# EAGLE schematic SCRIPPS_new_board_ (EAGLE 8.2.2)
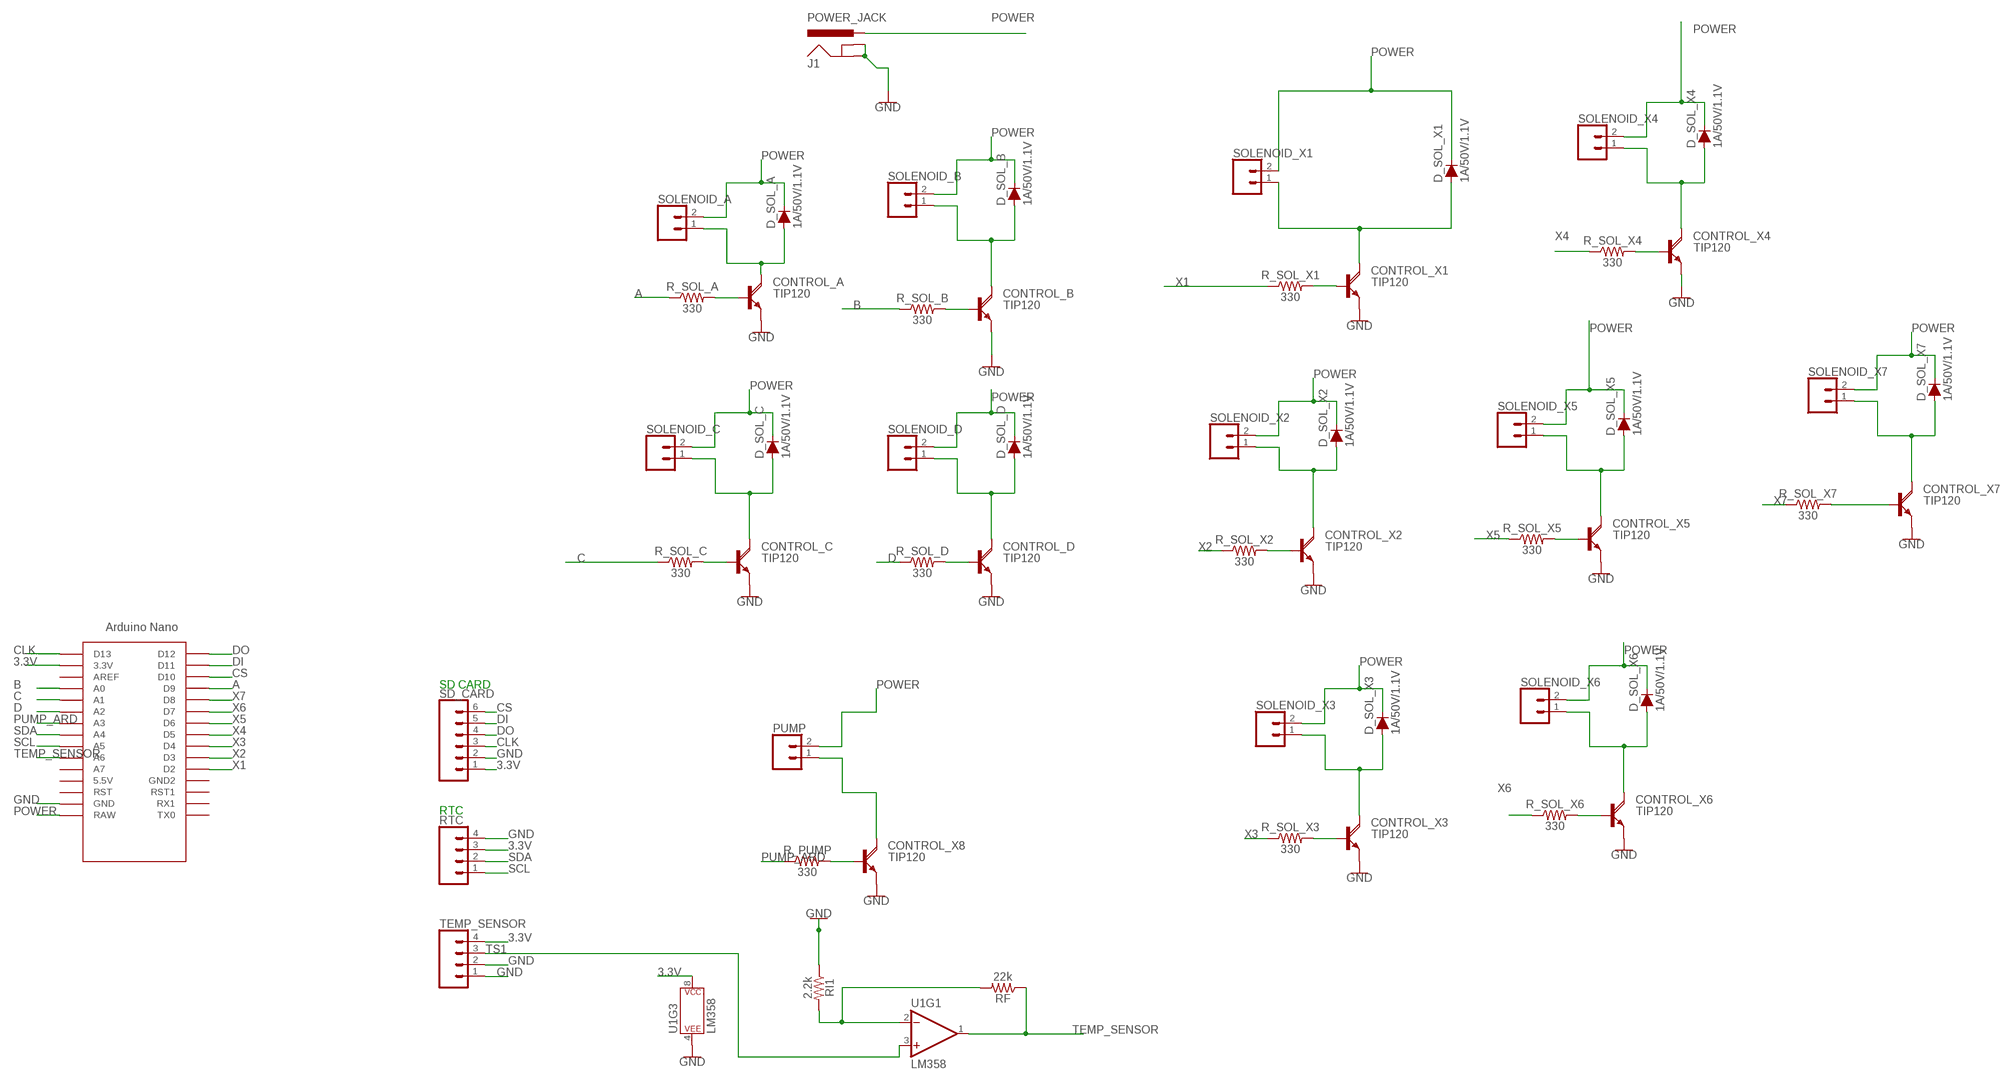
[diagram p0: schematic, sheet 1]

## Parts
CONTROL_A  TIP120  [TO220AH]
CONTROL_B  TIP120  [TO220AH]
CONTROL_C  TIP120  [TO220AH]
CONTROL_D  TIP120  [TO220AH]
CONTROL_X1  TIP120  [TO220AH]
CONTROL_X2  TIP120  [TO220AH]
CONTROL_X3  TIP120  [TO220AH]
CONTROL_X4  TIP120  [TO220AH]
CONTROL_X5  TIP120  [TO220AH]
CONTROL_X6  TIP120  [TO220AH]
CONTROL_X7  TIP120  [TO220AH]
CONTROL_X8  TIP120  [TO220AH]
D_SOL_A  1A/50V/1.1V  DIODE-PTH  [DIODE-1N4001]
D_SOL_B  1A/50V/1.1V  DIODE-PTH  [DIODE-1N4001]
D_SOL_C  1A/50V/1.1V  DIODE-PTH  [DIODE-1N4001]
D_SOL_D  1A/50V/1.1V  DIODE-PTH  [DIODE-1N4001]
D_SOL_X1  1A/50V/1.1V  DIODE-PTH  [DIODE-1N4001]
D_SOL_X2  1A/50V/1.1V  DIODE-PTH  [DIODE-1N4001]
D_SOL_X3  1A/50V/1.1V  DIODE-PTH  [DIODE-1N4001]
D_SOL_X4  1A/50V/1.1V  DIODE-PTH  [DIODE-1N4001]
D_SOL_X5  1A/50V/1.1V  DIODE-PTH  [DIODE-1N4001]
D_SOL_X6  1A/50V/1.1V  DIODE-PTH  [DIODE-1N4001]
D_SOL_X7  1A/50V/1.1V  DIODE-PTH  [DIODE-1N4001]
J1  POWER_JACK  [POWER_JACK_PTH]
PUMP  CONN_02  [1X02]
R_PUMP  330  330OHM-HORIZ-1/10W-5%  [AXIAL-0.3]
R_SOL_A  330  330OHM-HORIZ-1/10W-5%  [AXIAL-0.3]
R_SOL_B  330  330OHM-HORIZ-1/10W-5%  [AXIAL-0.3]
R_SOL_C  330  330OHM-HORIZ-1/10W-5%  [AXIAL-0.3]
R_SOL_D  330  330OHM-HORIZ-1/10W-5%  [AXIAL-0.3]
R_SOL_X1  330  330OHM-HORIZ-1/10W-5%  [AXIAL-0.3]
R_SOL_X2  330  330OHM-HORIZ-1/10W-5%  [AXIAL-0.3]
R_SOL_X3  330  330OHM-HORIZ-1/10W-5%  [AXIAL-0.3]
R_SOL_X4  330  330OHM-HORIZ-1/10W-5%  [AXIAL-0.3]
R_SOL_X5  330  330OHM-HORIZ-1/10W-5%  [AXIAL-0.3]
R_SOL_X6  330  330OHM-HORIZ-1/10W-5%  [AXIAL-0.3]
R_SOL_X7  330  330OHM-HORIZ-1/10W-5%  [AXIAL-0.3]
RF  22k  330OHM-HORIZ-1/10W-5%  [AXIAL-0.3]
RI1  2.2k  330OHM-HORIZ-1/10W-5%  [AXIAL-0.3]
RTC  CONN_04  [1X04]
SD_CARD  CONN_06FEMALE_LOCK  [1X06_FEMALE_LOCK.010]
SOLENOID_A  CONN_02  [1X02]
SOLENOID_B  CONN_02  [1X02]
SOLENOID_C  CONN_02  [1X02]
SOLENOID_D  CONN_02  [1X02]
SOLENOID_X1  CONN_02  [1X02]
SOLENOID_X2  CONN_02  [1X02]
SOLENOID_X3  CONN_02  [1X02]
SOLENOID_X4  CONN_02  [1X02]
SOLENOID_X5  CONN_02  [1X02]
SOLENOID_X6  CONN_02  [1X02]
SOLENOID_X7  CONN_02  [1X02]
TEMP_SENSOR  CONN_04  [1X04]
U1  LM358  [DIP08]
U$2  NANO  [NANO]

## Nets
3.3V: RTC.3 SD_CARD.1 TEMP_SENSOR.4 U1.8(P$V+) U$2.3.3V
A: R_SOL_A.P$1 U$2.D9
B: R_SOL_B.P$1 U$2.A0
C: R_SOL_C.P$1 U$2.A1
CLK: SD_CARD.3 U$2.D13
CS: SD_CARD.6 U$2.D10
D: R_SOL_D.P$1 U$2.A2
DI: SD_CARD.5 U$2.D11
DO: SD_CARD.4 U$2.D12
GND: CONTROL_A.E CONTROL_B.E CONTROL_C.E CONTROL_D.E CONTROL_X1.E CONTROL_X2.E CONTROL_X3.E CONTROL_X4.E CONTROL_X5.E CONTROL_X6.E CONTROL_X7.E CONTROL_X8.E J1.GND J1.GNDBREAK RI1.P$1 RTC.4 SD_CARD.2 TEMP_SENSOR.1 TEMP_SENSOR.2 U1.4(P$V-) U$2.GND
N$2: CONTROL_X8.B R_PUMP.P$2
N$3: CONTROL_X8.C PUMP.1
N$4: CONTROL_X1.C D_SOL_X1.A SOLENOID_X1.1
N$5: CONTROL_X1.B R_SOL_X1.P$2
N$6: CONTROL_C.B R_SOL_C.P$2
N$9: CONTROL_A.B R_SOL_A.P$2
N$10: CONTROL_A.C D_SOL_A.A SOLENOID_A.1
N$11: CONTROL_C.C D_SOL_C.A SOLENOID_C.1
N$12: RF.P$2 RI1.P$2 U1.2(-IN)
N$13: CONTROL_B.B R_SOL_B.P$2
N$14: CONTROL_B.C D_SOL_B.A SOLENOID_B.1
N$17: CONTROL_D.B R_SOL_D.P$2
N$18: CONTROL_D.C D_SOL_D.A SOLENOID_D.1
N$19: CONTROL_X5.B R_SOL_X5.P$2
N$20: CONTROL_X2.C D_SOL_X2.A SOLENOID_X2.1
N$21: CONTROL_X7.B R_SOL_X7.P$2
N$22: CONTROL_X7.C D_SOL_X7.A SOLENOID_X7.1
N$23: CONTROL_X5.C D_SOL_X5.A SOLENOID_X5.1
N$25: CONTROL_X4.B R_SOL_X4.P$2
N$26: CONTROL_X4.C D_SOL_X4.A SOLENOID_X4.1
N$29: CONTROL_X2.B R_SOL_X2.P$2
N$33: CONTROL_X3.B R_SOL_X3.P$2
N$34: CONTROL_X3.C D_SOL_X3.A SOLENOID_X3.1
N$36: CONTROL_X6.B R_SOL_X6.P$2
N$37: CONTROL_X6.C D_SOL_X6.A SOLENOID_X6.1
POWER: D_SOL_A.C D_SOL_B.C D_SOL_C.C D_SOL_D.C D_SOL_X1.C D_SOL_X2.C D_SOL_X3.C D_SOL_X4.C D_SOL_X5.C D_SOL_X6.C D_SOL_X7.C J1.PWR PUMP.2 SOLENOID_A.2 SOLENOID_B.2 SOLENOID_C.2 SOLENOID_D.2 SOLENOID_X1.2 SOLENOID_X2.2 SOLENOID_X3.2 SOLENOID_X4.2 SOLENOID_X5.2 SOLENOID_X6.2 SOLENOID_X7.2 U$2.RAW
PUMP_ARD: R_PUMP.P$1 U$2.A3
SCL: RTC.1 U$2.A5
SDA: RTC.2 U$2.A4
TEMP_SENSOR: RF.P$1 U1.1(OUT) U$2.A6
TS1: TEMP_SENSOR.3 U1.3(+IN)
X1: R_SOL_X1.P$1 U$2.D2
X2: R_SOL_X2.P$1 U$2.D3
X3: R_SOL_X3.P$1 U$2.D4
X4: R_SOL_X4.P$1 U$2.D5
X5: R_SOL_X5.P$1 U$2.D6
X6: R_SOL_X6.P$1 U$2.D7
X7: R_SOL_X7.P$1 U$2.D8
Unconnected: U1.5(+IN) U1.6(-IN) U1.7(OUT) U$2.5V(5.5V) U$2.A7 U$2.AREF U$2.GND1(GND2) U$2.ICSP1 U$2.ICSP2 U$2.ICSP3 U$2.ICSP4 U$2.ICSP5 U$2.ICSP6 U$2.RST U$2.RST1 U$2.RX1 U$2.TX0

## Notes on the sheet
- SD CARD
- RTC

## Library data of the parts
CONTROL_A CONTROL_B CONTROL_C CONTROL_D CONTROL_X1-CONTROL_X8 = transistor-power:TIP120: NPN DARLINGTON TRANSISTOR
D_SOL_A D_SOL_B D_SOL_C D_SOL_D D_SOL_X1-D_SOL_X7 = SparkFun-DiscreteSemi:DIODE: Diode These are standard reverse protection diodes and small signal diodes. SparkFun Products: SparkFun SparkPunk Sound Kit <https://www.sparkfun.com/products/11177> SparkFun ESP8266 Thing <https://www.sparkfun.com/products/13231>; PROD_ID: DIO-09176
J1 = SparkFun-Connectors:POWER_JACK: Power Jack Connector This is the standard 5.5mm barrel jack for power. The PTH is the most common, proven, reliable, footprint. The Slot footprint only works if the mill layer is transmitted to the PCB fab house so be warned. Here are the connectors we sell at SparkFun: DC Barrel Power Jack/Connector <https://www.sparkfun.com/products/119> (PRT-00119) DC Barrel Power Jack/Connector (SMD) <https://www.sparkfun.com/products/12748> (PRT-12748) DC Barrel Jack Adapter - Breadboard Compatible <https://www.sparkfun.com/products/10811> (PRT-10811) It is used on this SparkFun product (and many, many others): SparkFun RedBoard - Programmed with Arduino <https://www.sparkfun.com/products/12757> (DEV-12757) Also, if you need a mating power supply or connector, please check these out: Wall Adapter Power Supply - 9VDC 650mA <https://www.sparkfun.com/products/298> (TOL-00298) DC Barrel Jack Adapter - Male <https://www.sparkfun.com/products/10287> (PRT-10287); PROD_ID: CONN-08197
PUMP SOLENOID_A SOLENOID_B SOLENOID_C SOLENOID_D SOLENOID_X1-SOLENOID_X7 = SparkFun-Connectors:CONN_02: Multi connection point. Often used as Generic Header-pin footprint for 0.1 inch spaced/style header connections On any of the 0.1 inch spaced packages, you can populate with these: Break Away Headers - Straight <https://www.sparkfun.com/products/116> (PRT-00116) Break Away Male Headers - Right Angle <https://www.sparkfun.com/products/553> (PRT-00553) Female Headers <https://www.sparkfun.com/products/115> (PRT-00115) Break Away Headers - Machine Pin <https://www.sparkfun.com/products/117> (PRT-00117) Break Away Female Headers - Swiss Machine Pin <https://www.sparkfun.com/products/743> (PRT-00743) For SCREWTERMINALS and SPRING TERMINALS visit here: Screw Terimnals on SparkFun.com <https://www.sparkfun.com/search/results?term=Screw+Terminals> (5mm/3.5mm/2.54mm spacing) This device is also useful as a general connection point to wire up your design to another part of your project. Our various solder wires solder well into these plated through hole pads. Hook-Up Wire - Assortment (Stranded, 22 AWG) <https://www.sparkfun.com/products/11375> (PRT-11375) Hook-Up Wire - Assortment (Solid Core, 22 AWG) <https://www.sparkfun.com/products/11367> (PRT-11367) View the entire wire category on our website here <https://www.sparkfun.com/categories/141> Special notes: Molex polarized connector foot print use with: PRT-08233 with associated crimp pins and housings. 2.54_SCREWTERM for use with PRT-10571. 3.5mm Screw Terminal footprints for PRT-08084 5mm Screw Terminal footprints for use with PRT-08432
R_PUMP R_SOL_A R_SOL_B R_SOL_C R_SOL_D R_SOL_X1-R_SOL_X7 = SparkFun-Resistors:330OHM: 330Ω resistor A resistor is a passive two-terminal electrical component that implements electrical resistance as a circuit element. Resistors act to reduce current flow, and, at the same time, act to lower voltage levels within circuits. - Wikipedia; PROD_ID: RES-8371
RF RI1 = SparkFun-Resistors:330OHM: 330Ω resistor A resistor is a passive two-terminal electrical component that implements electrical resistance as a circuit element. Resistors act to reduce current flow, and, at the same time, act to lower voltage levels within circuits. - Wikipedia; PROD_ID: RES-8371; VALUE: 330
RTC TEMP_SENSOR = SparkFun-Connectors:CONN_04: Multi connection point. Often used as Generic Header-pin footprint for 0.1 inch spaced/style header connections On any of the 0.1 inch spaced packages, you can populate with these: Break Away Headers - Straight <https://www.sparkfun.com/products/116> (PRT-00116) Break Away Male Headers - Right Angle <https://www.sparkfun.com/products/553> (PRT-00553) Female Headers <https://www.sparkfun.com/products/115> (PRT-00115) Break Away Headers - Machine Pin <https://www.sparkfun.com/products/117> (PRT-00117) Break Away Female Headers - Swiss Machine Pin <https://www.sparkfun.com/products/743> (PRT-00743) For SCREWTERMINALS and SPRING TERMINALS visit here: Screw Terimnals on SparkFun.com <https://www.sparkfun.com/search/results?term=Screw+Terminals> (5mm/3.5mm/2.54mm spacing) This device is also useful as a general connection point to wire up your design to another part of your project. Our various solder wires solder well into these plated through hole pads. Hook-Up Wire - Assortment (Stranded, 22 AWG) <https://www.sparkfun.com/products/11375> (PRT-11375) Hook-Up Wire - Assortment (Solid Core, 22 AWG) <https://www.sparkfun.com/products/11367> (PRT-11367) View the entire wire category on our website here <https://www.sparkfun.com/categories/141> Special notes: Molex polarized connector foot print use with SKU : PRT-08231 with associated crimp pins and housings. 1MM SMD Version SKU: PRT-10208; PROD_ID: CONN-09696
SD_CARD = SparkFun-Connectors:CONN_06: Multi connection point. Often used as Generic Header-pin footprint for 0.1 inch spaced/style header connections On any of the 0.1 inch spaced packages, you can populate with these: Break Away Headers - Straight <https://www.sparkfun.com/products/116> (PRT-00116) Break Away Male Headers - Right Angle <https://www.sparkfun.com/products/553> (PRT-00553) Female Headers <https://www.sparkfun.com/products/115> (PRT-00115) Break Away Headers - Machine Pin <https://www.sparkfun.com/products/117> (PRT-00117) Break Away Female Headers - Swiss Machine Pin <https://www.sparkfun.com/products/743> (PRT-00743) Arduino Stackable Header - 6 Pin <https://www.sparkfun.com/products/9280> (PRT-09280) For SCREWTERMINALS and SPRING TERMINALS visit here: Screw Terimnals on SparkFun.com <https://www.sparkfun.com/search/results?term=Screw+Terminals> (5mm/3.5mm/2.54mm spacing) This device is also useful as a general connection point to wire up your design to another part of your project. Our various solder wires solder well into these plated through hole pads. Hook-Up Wire - Assortment (Stranded, 22 AWG) <https://www.sparkfun.com/products/11375> (PRT-11375) Hook-Up Wire - Assortment (Solid Core, 22 AWG) <https://www.sparkfun.com/products/11367> (PRT-11367) View the entire wire category on our website here <https://www.sparkfun.com/categories/141>
U1 = SparkFun-IC-Amplifiers:LM358: LM358 Jellybean op-amp Datasheet <http://www.sparkfun.com/datasheets/Components/General/LM358.pdf> SparkFun Products Op-Amp (Thru-Hole) - LM358 <https://www.sparkfun.com/products/9456> (COM-09456); PROD_ID: IC-09172
U$2 = Arduino-clone:NANO: Arduino Nano

## Net classes
0 edit1: width 0.406 mm